# EAGLE schematic sePentodeOutput (EAGLE 7.7.0)
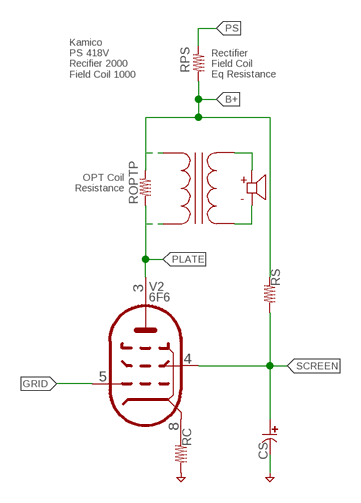
[diagram p0: schematic, sheet 1]

## Parts
CS  C-POLARIZED-E-3  [C-E-3]
RC  R-THRU-H-0.4  [R-THRU-H-0.4]
ROPTP  R-THRU-H-0.4  [R-THRU-H-0.4]
RPS  R-THRU-H-0.4  [R-THRU-H-0.4]
RS  R-THRU-H-0.4  [R-THRU-H-0.4]
S  4  SPEAKER-CEM-1201-42  [SPEAKER-CEM-1201-42]
T  TRANSFORMER-2-2  [TRANSFORMER-4-2-G]
V2  6F6  6F6GT-P  [OKTAL]

## Nets
B+: ROPTP.1 RPS.2 RS.1 T.1
GND: CS.- RC.2
GRID: V2.5(PG)
N$1: S.P T.5(S1)
N$2: S.M T.6(S2)
N$3: RC.1 V2.8(PK)
PLATE: ROPTP.2 T.2 V2.3(PA)
PS: RPS.1
SCREEN: CS.+ RS.2 V2.4(PSG)
Unconnected: V2.2(H1) V2.7(H2)

## Notes on the sheet
- Kamico
  PS 418V
  Recifier 2000
  Field Coil 1000
- Rectifier
  Field Coil
  Eq Resistance
- OPT Coil
  Resistance

## Library data of the parts
CS = holla:C-POLARIZED
RC ROPTP RPS RS = holla:R
S = holla:SPEAKER-CEM-1201-42: Audio Buzzer Magnetic 1Vo-p 2Vo-p 20mA 1.5Vo-p 85dBA Pin Through Hole Tray; AVAILABILITY: Good; DESCRIPTION: Audio Buzzer Magnetic 1Vo-p 2Vo-p 20mA 1.5Vo-p 85dBA Pin Through Hole Tray; MF: CUI; MP: CEM-1201_42_; PACKAGE: CUI; PRICE: 0.43 USD
T = holla:TRANSFORMER-2-2: TRANSFORMER 2 x primary, 2 x secondary
V2 = tubes:6F6GT-P